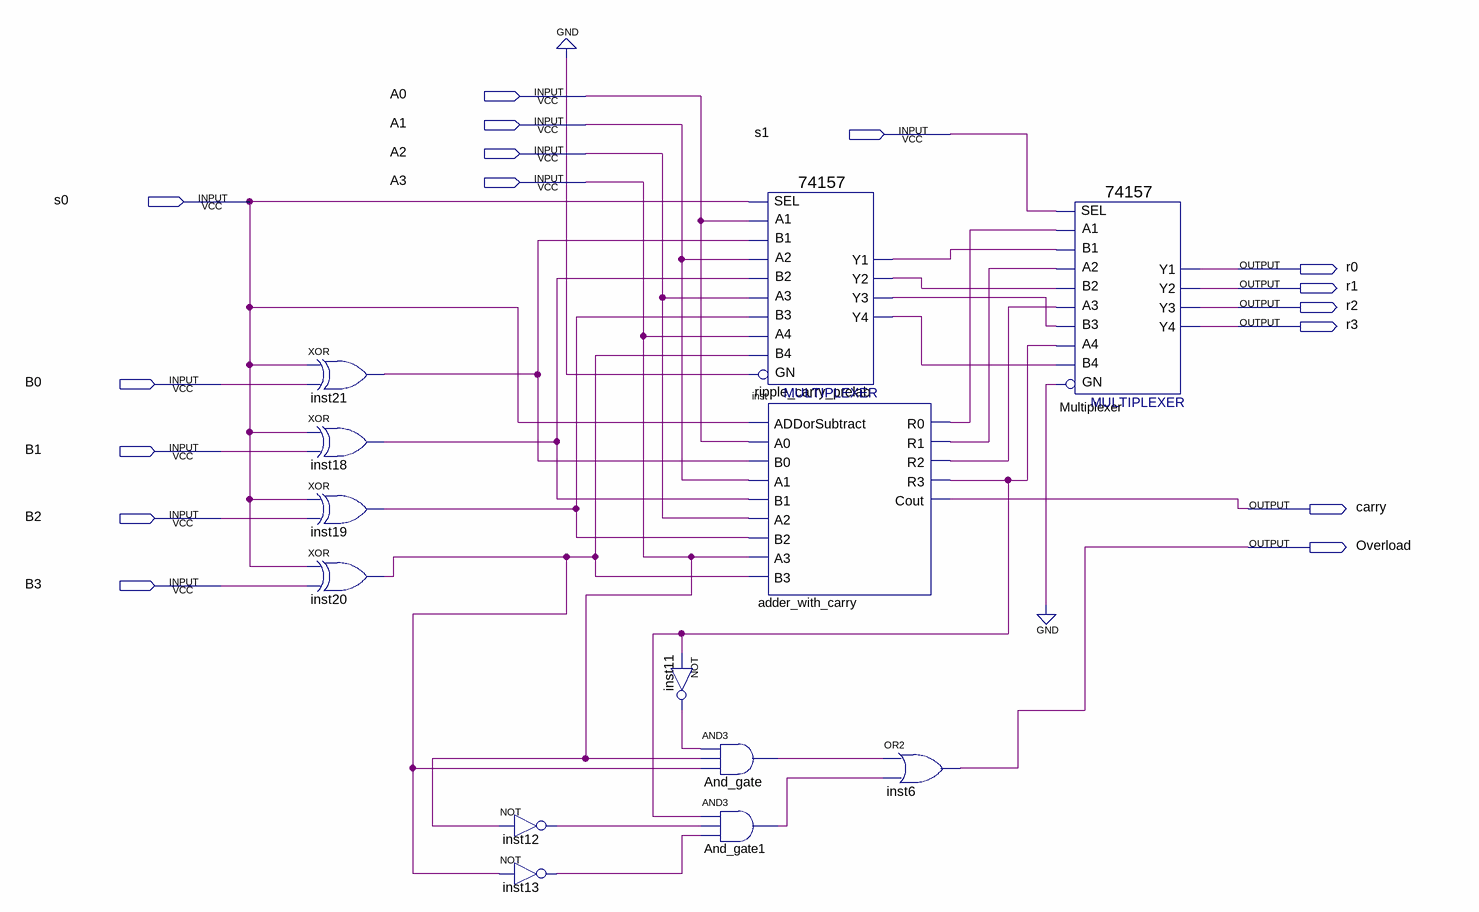
[diagram p0: schematic sheet]
// Quartus schematic ALU_final.bdf as structural Verilog: 13 symbols, 16 pins
module ALU_final (
  input  A0,
  input  A1,
  input  s1,
  input  A2,
  input  A3,
  input  s0,
  input  B0,
  input  B1,
  input  B2,
  input  B3,
  output r0,
  output r1,
  output r2,
  output r3,
  output carry,
  output Overload
);

  wire adder_with_carry_r0, adder_with_carry_r1, adder_with_carry_r2, adder_with_carry_r3, And_gate1_out,
       And_gate_out, inst11_out, inst12_out, inst13_out, inst18_out, inst19_out, inst20_out, inst21_out,
       inst_y1, inst_y2, inst_y3, inst_y4;

  xor inst21 (inst21_out, s0, B0);
  xor inst18 (inst18_out, s0, B1);
  xor inst19 (inst19_out, s0, B2);
  xor inst20 (inst20_out, s0, B3);
  not inst12 (inst12_out, A3);
  not inst13 (inst13_out, inst20_out);
  not inst11 (inst11_out, adder_with_carry_r3);
  \74157  inst (
    .A1(A0), .B1(inst21_out), .SEL(s0), .B2(inst18_out), .A3(A2), .B3(inst19_out), .A2(A1), .B4(inst20_out),
    .GN(1'b0), .A4(A3), .Y2(inst_y2), .Y1(inst_y1), .Y4(inst_y4), .Y3(inst_y3));
  ripple_carry_prelab adder_with_carry (
    .ADDorSubtract(s0), .A0(A0), .B0(inst21_out), .A1(A1), .B1(inst18_out), .A2(A2), .B2(inst19_out),
    .A3(A3), .B3(inst20_out), .R0(adder_with_carry_r0), .R1(adder_with_carry_r1), .R2(adder_with_carry_r2),
    .R3(adder_with_carry_r3), .Cout(carry));
  and And_gate (And_gate_out, inst11_out, A3, inst20_out);
  and And_gate1 (And_gate1_out, adder_with_carry_r3, inst12_out, inst13_out);
  or inst6 (Overload, And_gate_out, And_gate1_out);
  \74157  Multiplexer (
    .A1(adder_with_carry_r0), .B1(inst_y1), .SEL(s1), .B2(inst_y2), .A3(adder_with_carry_r2), .B3(inst_y3),
    .A2(adder_with_carry_r1), .B4(inst_y4), .GN(1'b0), .A4(adder_with_carry_r3), .Y2(r1), .Y1(r0), .Y4(r3),
    .Y3(r2));
endmodule
